# EAGLE design Kruispunt schema v2 (EAGLE 9.1.2)
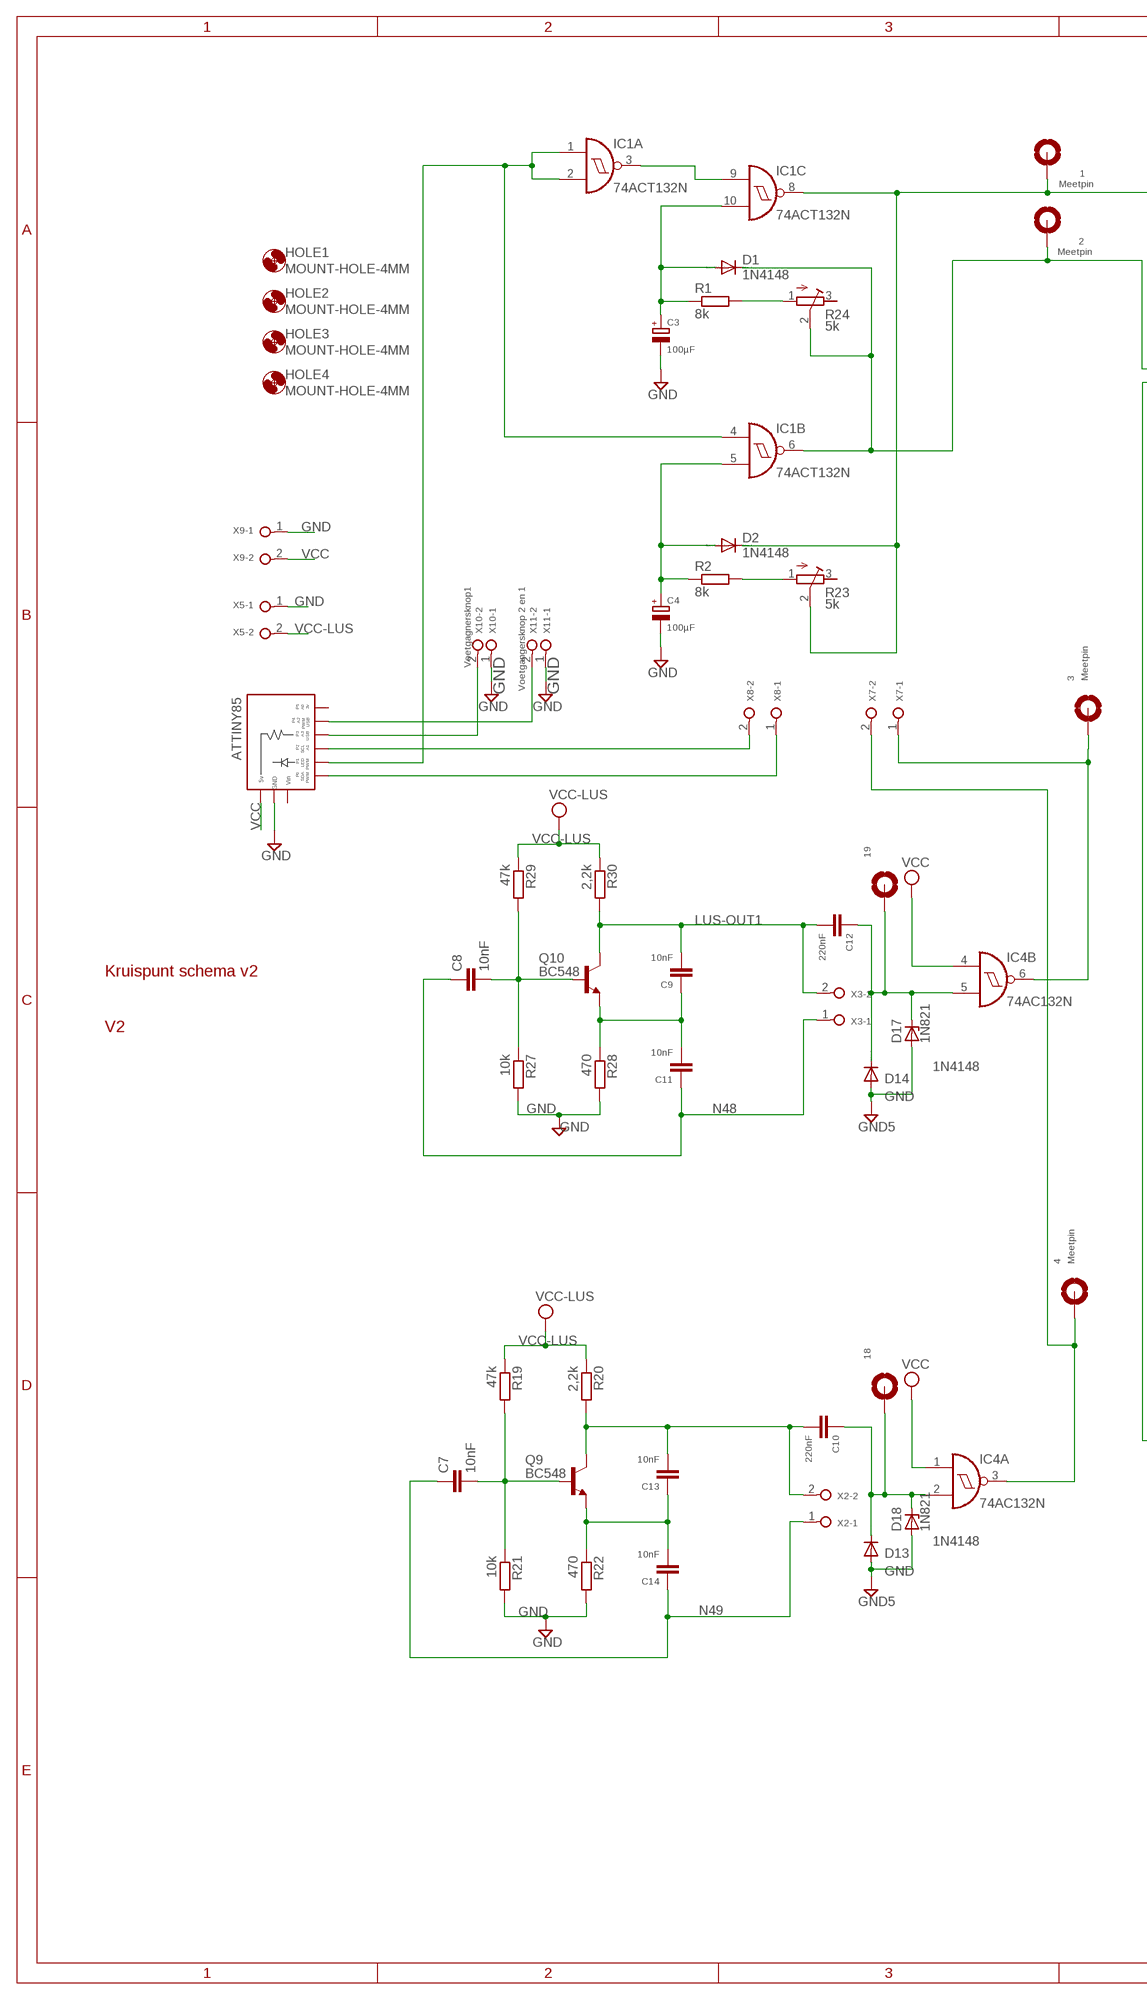
[diagram p0: schematic, sheet 1, part 1 of 2]
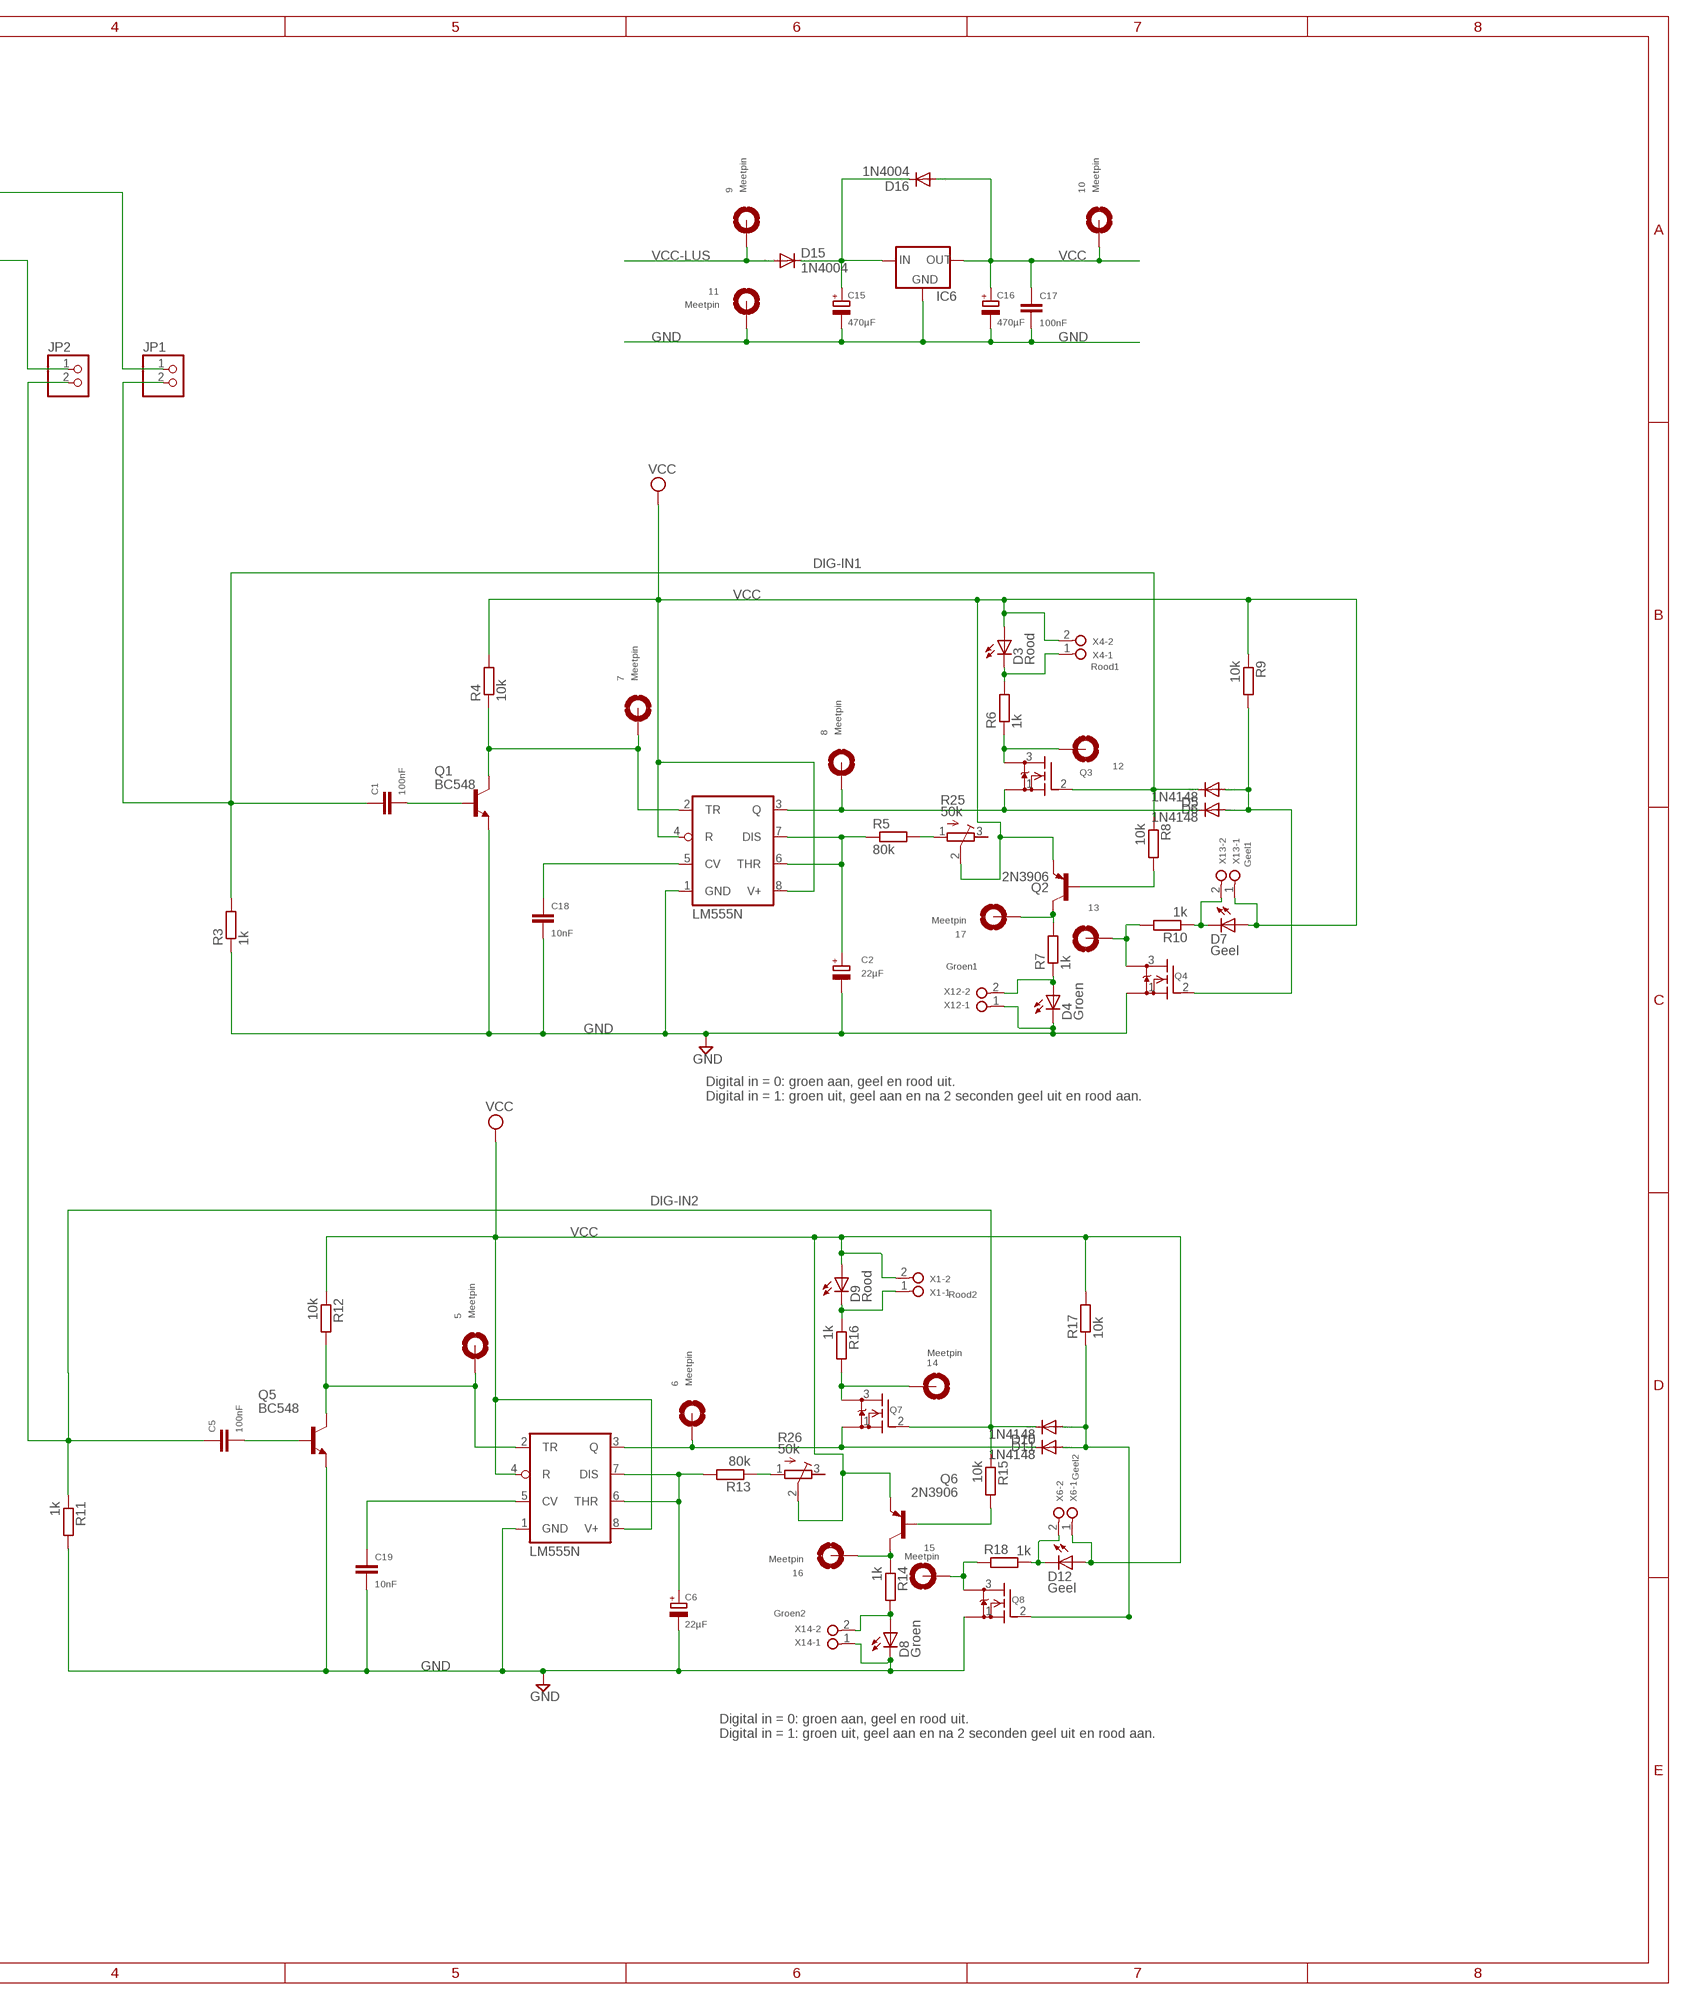
[diagram p1: schematic, sheet 1, part 2 of 2]

## Parts
1  Meetpin  WIREPAD  [PAD]
2  Meetpin  WIREPAD  [PAD]
3  Meetpin  WIREPAD  [PAD]
4  Meetpin  WIREPAD  [PAD]
5  Meetpin  WIREPAD  [PAD]
6  Meetpin  WIREPAD  [PAD]
7  Meetpin  WIREPAD  [PAD]
8  Meetpin  WIREPAD  [PAD]
9  Meetpin  WIREPAD  [PAD]
10  Meetpin  WIREPAD  [PAD]
11  Meetpin  WIREPAD  [PAD]
12  WIREPAD  [PAD]
13  WIREPAD  [PAD]
14  Meetpin  WIREPAD  [PAD]
15  Meetpin  WIREPAD  [PAD]
16  Meetpin  WIREPAD  [PAD]
17  Meetpin  WIREPAD  [PAD]
18  WIREPAD  [PAD]
19  WIREPAD  [PAD]
ATTINY85  DIGISPARK  [DIGISPARK]
C1  100nF  CERAMIC-CAP2LEADS  [CERAMIC-CAP-C050-025X075]
C2  22µF  ELCOELCO2,5MMLEAD  [ELCO-2.5MMLEAD]
C3  100µF  ELCOELCO2,5MMLEAD  [ELCO-2.5MMLEAD]
C4  100µF  ELCOELCO2,5MMLEAD  [ELCO-2.5MMLEAD]
C5  100nF  CERAMIC-CAP2LEADS  [CERAMIC-CAP-C050-025X075]
C6  22µF  ELCOELCO2,5MMLEAD  [ELCO-2.5MMLEAD]
C7  10nF  CERAMIC-CAP2LEADS  [CERAMIC-CAP-C050-025X075]
C8  10nF  CERAMIC-CAP2LEADS  [CERAMIC-CAP-C050-025X075]
C9  10nF  CERAMIC-CAP2LEADS  [CERAMIC-CAP-C050-025X075]
C10  220nF  CERAMIC-CAP3LEADS  [CERAMIC-CAP-C025_050-035X075]
C11  10nF  CERAMIC-CAP2LEADS  [CERAMIC-CAP-C050-025X075]
C12  220nF  CERAMIC-CAP3LEADS  [CERAMIC-CAP-C025_050-035X075]
C13  10nF  CERAMIC-CAP2LEADS  [CERAMIC-CAP-C050-025X075]
C14  10nF  CERAMIC-CAP2LEADS  [CERAMIC-CAP-C050-025X075]
C15  470µF  ELCOELCO5,0MMLEAD  [ELCO-5,0MMLEAD]
C16  470µF  ELCOELCO5,0MMLEAD  [ELCO-5,0MMLEAD]
C17  100nF  CERAMIC-CAP2LEADS  [CERAMIC-CAP-C050-025X075]
C18  10nF  CERAMIC-CAP2LEADS  [CERAMIC-CAP-C050-025X075]
C19  10nF  CERAMIC-CAP2LEADS  [CERAMIC-CAP-C050-025X075]
D1  1N4148  1N4148DO35-7  [DO35-7]
D2  1N4148  1N4148DO35-7  [DO35-7]
D3  Rood  TLLY4400  [LED3MM]
D4  Groen  TLLY4400  [LED3MM]
D5  1N4148  1N4148DO35-7  [DO35-7]
D6  1N4148  1N4148DO35-7  [DO35-7]
D7  Geel  TLLY4400  [LED3MM]
D8  Groen  TLLY4400  [LED3MM]
D9  Rood  TLLY4400  [LED3MM]
D10  1N4148  1N4148DO35-7  [DO35-7]
D11  1N4148  1N4148DO35-7  [DO35-7]
D12  Geel  TLLY4400  [LED3MM]
D13  1N4148  1N4148DO35-7  [DO35-7]
D14  1N4148  1N4148DO35-7  [DO35-7]
D15  1N4004  1N4148DO35-7  [DO35-7]
D16  1N4004  1N4148DO35-7  [DO35-7]
D17  1N821  [DO35Z10]
D18  1N821  [DO35Z10]
HOLE1  MOUNT-HOLE-4MM  [4,0]
HOLE2  MOUNT-HOLE-4MM  [4,0]
HOLE3  MOUNT-HOLE-4MM  [4,0]
HOLE4  MOUNT-HOLE-4MM  [4,0]
IC1  74ACT132N  [DIL14]
IC2  LM555N  [DIL08]
IC3  LM555N  [DIL08]
IC4  74AC132N  [DIL14]
IC6  LM78XX-TO220LM78XX-HEATSINK  [LM78XX-HEATSINK]
JP1  PINHD-1X2  [1X02]
JP2  PINHD-1X2  [1X02]
Q1  BC548  [TO92-CBE]
Q2  2N3906  [TO92-EBC]
Q3  2N7000  [TO-92]
Q4  2N7000  [TO-92]
Q5  BC548  [TO92-CBE]
Q6  2N3906  [TO92-EBC]
Q7  2N7000  [TO-92]
Q8  2N7000  [TO-92]
Q9  BC548  [TO92-CBE]
Q10  BC548  [TO92-CBE]
R1  8k  RESISTOR  [0207/10]
R2  8k  RESISTOR  [0207/10]
R3  1k  RESISTOR  [0207/10]
R4  10k  RESISTOR  [0207/10]
R5  80k  RESISTOR  [0207/10]
R6  1k  RESISTOR  [0207/10]
R7  1k  RESISTOR  [0207/10]
R8  10k  RESISTOR  [0207/10]
R9  10k  RESISTOR  [0207/10]
R10  1k  RESISTOR  [0207/10]
R11  1k  RESISTOR  [0207/10]
R12  10k  RESISTOR  [0207/10]
R13  80k  RESISTOR  [0207/10]
R14  1k  RESISTOR  [0207/10]
R15  10k  RESISTOR  [0207/10]
R16  1k  RESISTOR  [0207/10]
R17  10k  RESISTOR  [0207/10]
R18  1k  RESISTOR  [0207/10]
R19  47k  RESISTOR  [0207/10]
R20  2,2k  RESISTOR  [0207/10]
R21  10k  RESISTOR  [0207/10]
R22  470  RESISTOR  [0207/10]
R23  5k  R-TRIMM64W  [RTRIM64W]
R24  5k  R-TRIMM64W  [RTRIM64W]
R25  50k  R-TRIMM64W  [RTRIM64W]
R26  50k  R-TRIMM64W  [RTRIM64W]
R27  10k  RESISTOR  [0207/10]
R28  470  RESISTOR  [0207/10]
R29  47k  RESISTOR  [0207/10]
R30  2,2k  RESISTOR  [0207/10]
X1  Rood2  TERMINAL-5MM-2POLE  [W237-132]
X2  TERMINAL-5MM-2POLE  [W237-132]
X3  TERMINAL-5MM-2POLE  [W237-132]
X4  Rood1  TERMINAL-5MM-2POLE  [W237-132]
X5  TERMINAL-5MM-2POLE  [W237-132]
X6  Geel2  TERMINAL-5MM-2POLE  [W237-132]
X7  TERMINAL-5MM-2POLE  [W237-132]
X8  TERMINAL-5MM-2POLE  [W237-132]
X9  TERMINAL-5MM-2POLE  [W237-132]
X10  Voetgagnersknop1  TERMINAL-5MM-2POLE  [W237-132]
X11  Voetgangersknop 2 en 1  TERMINAL-5MM-2POLE  [W237-132]
X12  Groen1  TERMINAL-5MM-2POLE  [W237-132]
X13  Geel1  TERMINAL-5MM-2POLE  [W237-132]
X14  Groen2  TERMINAL-5MM-2POLE  [W237-132]

## Nets
DIG-IN1: C1.P$2 D6.C JP1.2 Q3.2(G) R3.2 R8.1
DIG-IN2: C5.P$2 D11.C JP2.2 Q7.2(G) R11.1 R15.1
GND [VCC]: 11.P$1(MOUNT) ATTINY85.GND ATTINY85.GND1(GND) C2.- C3.- C4.- C6.- C15.- C16.- C17.P$1 C18.P$1 C19.P$1 D4.K(C) D8.K(C) D13.A D14.A D17.A D18.A IC2.1(GND) IC3.1(GND) IC6.GND Q1.E Q4.1(S) Q5.E Q8.1(S) R3.1 R11.2 R21.2 R22.2 R27.2 R28.2 X5.1 X9.1 X10.1 X11.1 X12.1 X14.1 ; supply symbol labelled GND5
LUS-OUT1: C9.P$1 C12.P$1 Q10.C R30.2 X3.2
N48 [VCC]: C8.P$2 C11.P$2 X3.1
N49 [VCC]: C7.P$2 C14.P$2 X2.1
N$1: C4.+ D2.A IC1.5(B:I1) R2.1
N$2: IC1.3(A:O) IC1.9(C:I0)
N$3: ATTINY85.P1 IC1.1(A:I0) IC1.2(A:I1) IC1.4(B:I0)
N$4: C1.P$1 Q1.B
N$5: R13.1 R26.1(A)
N$6: 1.P$1(MOUNT) D2.C IC1.8(C:O) JP1.1 R23.2(S)
N$7: C3.+ D1.A IC1.10(C:I1) R1.1
N$8: 7.P$1(MOUNT) IC2.2(TR) Q1.C R4.1
N$9: C2.+ IC2.6(THR) IC2.7(DIS) R5.1
N$10: 17.P$1(MOUNT) Q2.C R7.2
N$11: D4.A R7.1 X12.2
N$12: Q2.B R8.2
N$13: 12.P$1(MOUNT) Q3.3(D) R6.1
N$14: D3.K(C) R6.2 X4.1
N$15: 8.P$1(MOUNT) D5.C IC2.3(Q) Q3.1(S)
N$16: R2.2 R23.1(A)
N$17: 13.P$1(MOUNT) Q4.3(D) R10.2
N$18: D7.K(C) R10.1 X13.2
N$19: C5.P$1 Q5.B
N$20: 5.P$1(MOUNT) IC3.2(TR) Q5.C R12.2
N$21: C6.+ IC3.6(THR) IC3.7(DIS) R13.2
N$22: 16.P$1(MOUNT) Q6.C R14.1
N$23: D8.A R14.2 X14.2
N$24: Q6.B R15.2
N$25: 14.P$1(MOUNT) Q7.3(D) R16.2
N$26: ATTINY85.P3 X10.2
N$27: 6.P$1(MOUNT) D10.C IC3.3(Q) Q7.1(S)
N$28: D10.A D11.A Q8.2(G) R17.1
N$29: 15.P$1(MOUNT) Q8.3(D) R18.1
N$30: D12.K(C) R18.2 X6.2
N$31: C7.P$1 Q9.B R19.2 R21.1
N$32: C13.P$2 C14.P$1 Q9.E R22.1
N$33: C10.P$1 C13.P$1 Q9.C R20.2 X2.2
N$34: 18.P$1(MOUNT) C10.P$2 C10.P$3 D13.C D18.C IC4.2(A:I1)
N$35: 4.P$1(MOUNT) IC4.3(A:O) X7.2
N$36: R1.2 R24.1(A)
N$37: R5.2 R25.1(A)
N$38: C19.P$2 IC3.5(CV)
N$39: C8.P$1 Q10.B R27.1 R29.2
N$40: C9.P$2 C11.P$1 Q10.E R28.1
N$41: D5.A D6.A Q4.2(G) R9.2
N$42: 19.P$1(MOUNT) C12.P$2 C12.P$3 D14.C D17.C IC4.5(B:I1)
N$43: C18.P$2 IC2.5(CV)
N$44: 3.P$1(MOUNT) IC4.6(B:O) X7.1
N$45: C15.+ D15.C D16.C IC6.IN
N$46: ATTINY85.P4 X11.2
N$47: 2.P$1(MOUNT) D1.C IC1.6(B:O) JP2.1 R24.2(S)
N$48: ATTINY85.P2 X8.2
N$49: D9.K(C) R16.1 X1.1
N$50: ATTINY85.P0 X8.1
VCC [VCC]: 10.P$1(MOUNT) ATTINY85.5V ATTINY85.5V1(5V) C16.+ C17.P$2 D3.A D7.A D9.A D12.A D16.A IC2.4(R) IC2.8(V+) IC3.4(R) IC3.8(V+) IC4.1(A:I0) IC4.4(B:I0) IC6.OUT Q2.E Q6.E R4.2 R9.1 R12.1 R17.2 R25.2(S) R26.2(S) X1.2 X4.2 X6.1 X9.2 X13.1
VCC-LUS [VCC]: 9.P$1(MOUNT) D15.A R19.1 R20.1 R29.1 R30.1 X5.2
Unconnected: ATTINY85.P5 IC1.11(D:O) IC1.12(D:I0) IC1.13(D:I1) IC4.8(C:O) IC4.9(C:I0) IC4.10(C:I1) IC4.11(D:O) IC4.12(D:I0) IC4.13(D:I1) R23.3(E) R24.3(E) R25.3(E) R26.3(E)

## Notes on the sheet
- V2
- Digital in = 0: groen aan, geel en rood uit.
  Digital in = 1: groen uit, geel aan en na 2 seconden geel uit en rood aan.
- Digital in = 0: groen aan, geel en rood uit.
  Digital in = 1: groen uit, geel aan en na 2 seconden geel uit en rood aan.

## Power pins joined to a net without a drawn wire
GND: IC1.7(P:GND) IC4.7(P:GND)
VCC: IC1.14(P:VCC) IC4.14(P:VCC)
VIN: ATTINY85.VIN ATTINY85.VIN1(VIN)

## Library data of the parts
1-19 = Kruispunt Library:WIREPAD: Wirepad
ATTINY85 = Kruispunt Library:DIGISPARK: Digispark http://digistump.com/wiki/digispark
C1 C5 C7-C9 C11 C13 C14 C17-C19 = test(3):CERAMIC-CAP: ceramic capacitor leads 2.5mm and 5.5mm
C2-C4 C6 C15 C16 = Kruispunt Library:ELCO: electrolytic capacitor 2.5mm or 3.5mm lead or SMD
C10 C12 = Kruispunt Library:CERAMIC-CAP: ceramic capacitor leads 2.5mm and 5.5mm
D1 D2 D5 D6 D10 D11 D13-D16 = Kruispunt Library:1N4148: DIODE high speed (Philips)
D3 D4 D7-D9 D12 = Hardware lichtsturing library:TLLY4400: Low Current (2mA) LED 3 mm Tinted Diffused Package color YELLOW Source: Data sheet <http://www.farnell.com/datasheets/391098.pdf>; MF: VISHAY SEMICONDUCTOR; OC_FARNELL: 1612439
D17 D18 = Kruispunt Library:1N821: Reference DIODE temperature compensated, 6,2 V
HOLE1-HOLE4 = Kruispunt Library:MOUNT-HOLE-4MM
IC1 IC4 = Kruispunt Library:74*132: Quad 2-input NAND schmitt trigger
IC2 IC3 = Kruispunt Library:*555: TIMER
IC6 = Kruispunt Library:LM78XX-TO220: LM78xx TO220 VOLTAGE REGULATOR
JP1 JP2 = Kruispunt Library:PINHD-1X2: PIN HEADER
Q1 Q5 Q9 Q10 = Kruispunt Library:BC548*: NPN Transistor
Q2 Q6 = Kruispunt Library:2N3906: PNP Transistor
Q3 Q4 Q7 Q8 = Kruispunt Library:2N7000: Silicon N-Channel MOS FET 0.35A TTL-logic
R1-R22 R27-R30 = Kruispunt Library:RESISTOR
R23-R26 = Kruispunt Library:R-TRIMM: Trimm resistor
X1-X14 = Kruispunt Library:TERMINAL-5MM-2POLE: WAGO SCREW CLAMP; OC_FARNELL: unknown; OC_NEWARK: unknown

## Net classes
0 default: clearance 0.205 mm
1 VCC: width 1.016 mm, clearance 0.205 mm to class 0, clearance 0.205 mm

## Board
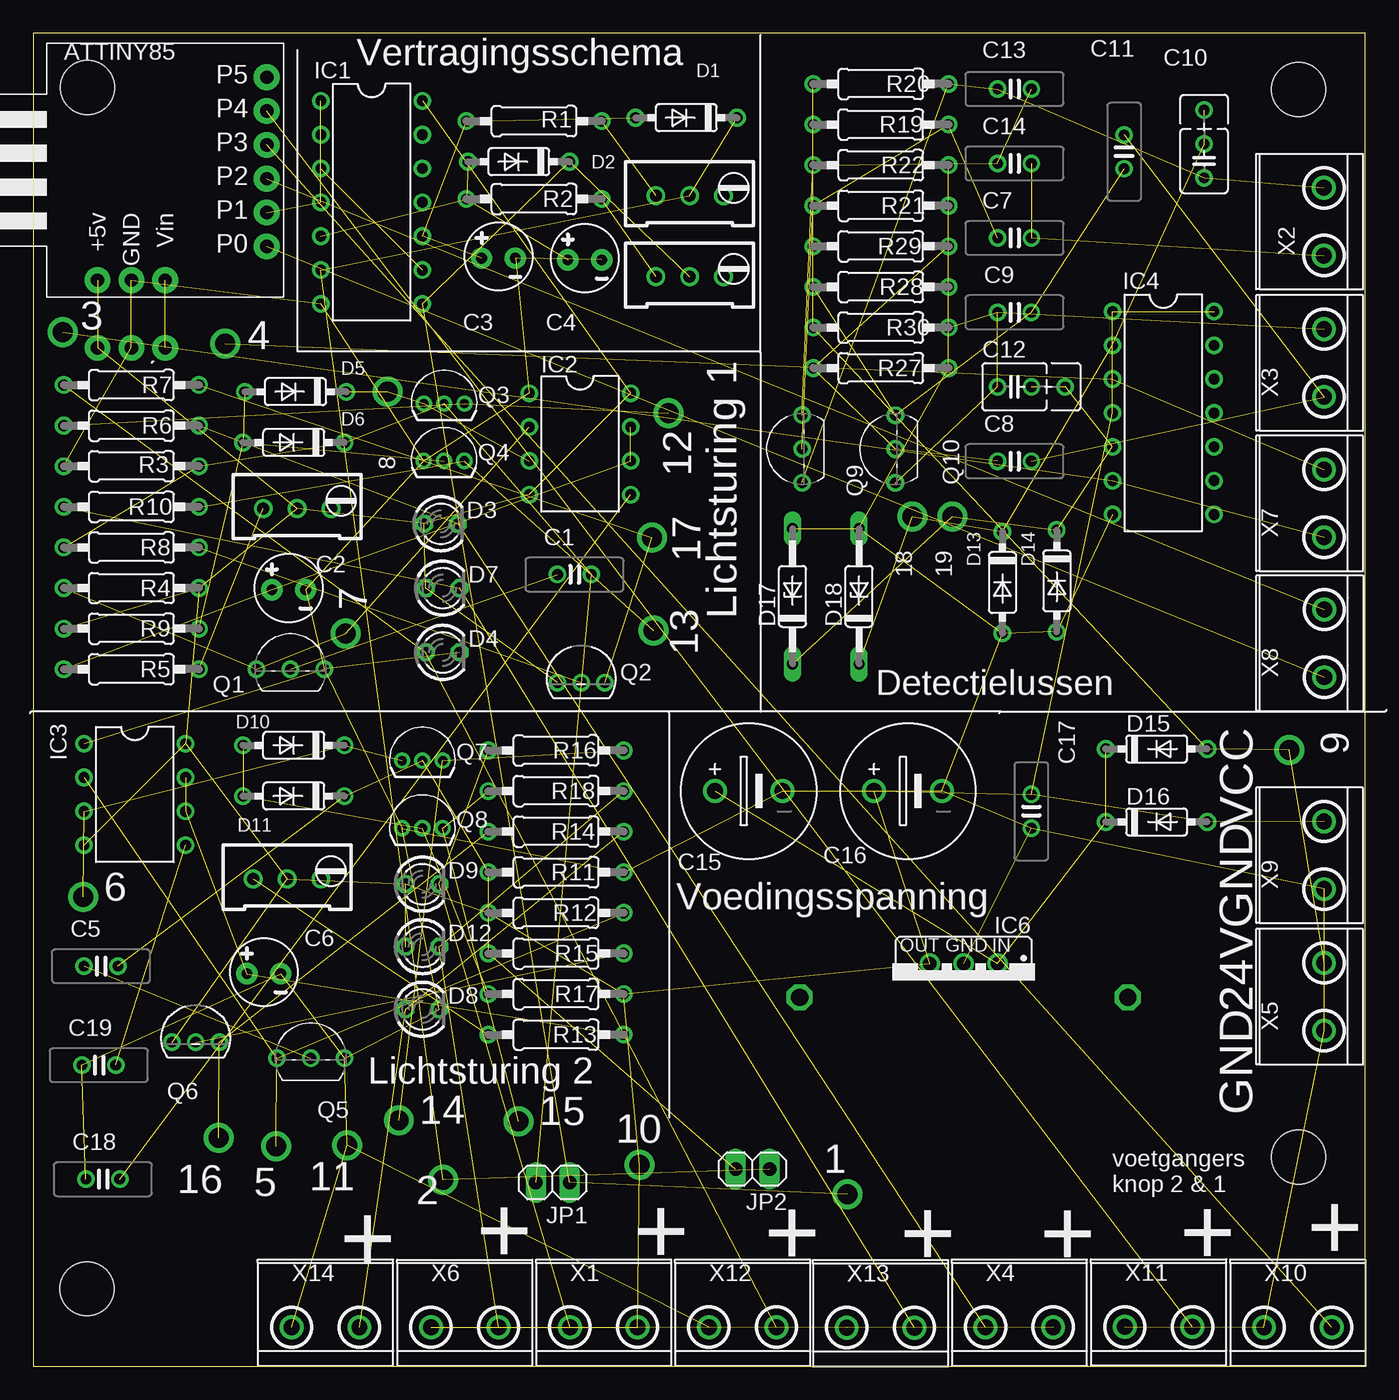
[diagram p2: board, top side]
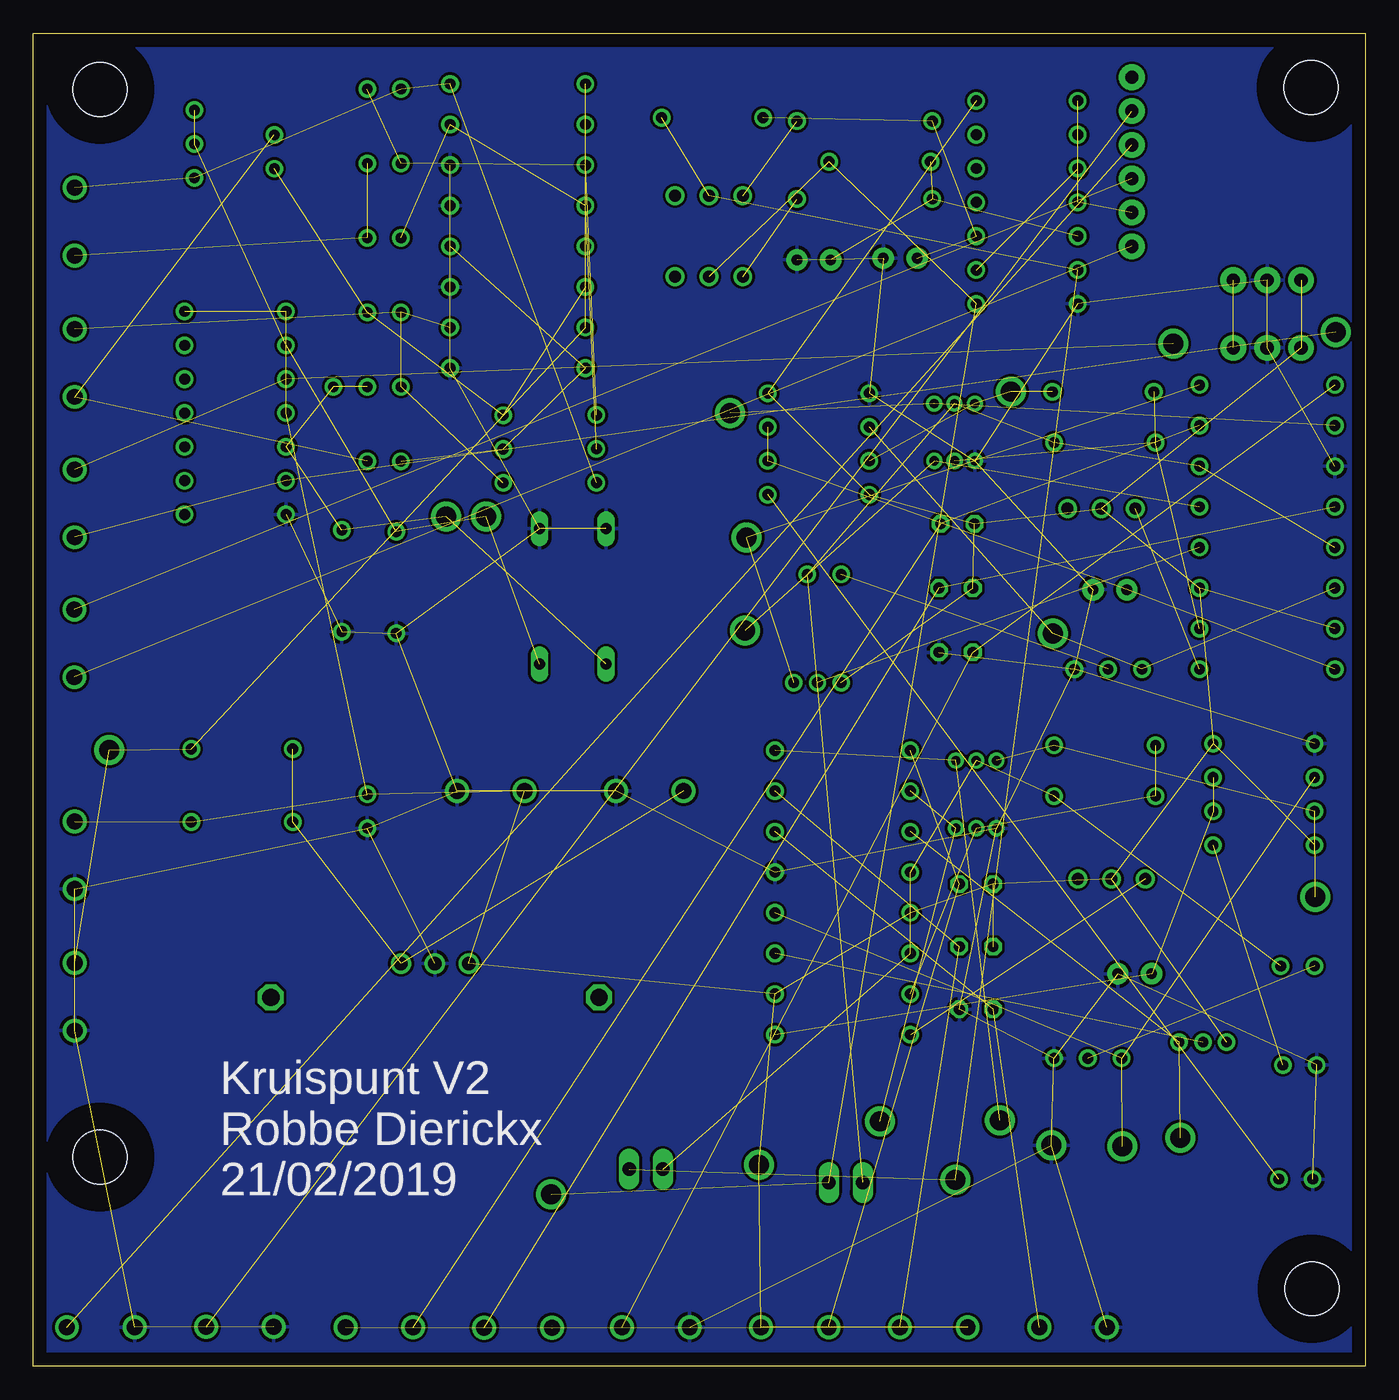
[diagram p3: board, bottom side, seen from below]

Size 100 x 100.07 mm. Coordinates in mm from the lower left corner, seen from the top.
Outline: 0,0 100,0 100,100.07 0,100.07 0,0
Copper layers (1*16): Top 0.035mm / dielectric 1.5mm / Bottom 0.035mm
Design rules "default *": minimum track width 10mil, minimum drill 0.35mm, track to track 8mil, track to pad 8mil, pad to pad 8mil, via to via 8mil, smd to smd 6mil, copper to edge 40mil, drill to drill 8mil, minimum pad ring 10mil, minimum via ring 8mil, stop-mask expansion 4mil, vias tented up to drill 0mil, thermal gap 10mil

### Footprints (pad centres in the part's own frame; a part is rotated, then mirrored left to right if it is on the bottom)
PAD = drill 1.5: P$1 0,0
DIGISPARK = drill 1 pad 1.93: 5V 17.78,3.81; 5V1 22.86,3.81; GND 17.78,6.35; GND1 22.86,6.35; P0 15.24,16.51; P1 12.7,16.51; P2 10.16,16.51; P3 7.62,16.51; P4 5.08,16.51; P5 2.54,16.51; VIN 17.78,8.89; VIN1 22.86,8.89
CERAMIC-CAP-C050-025X075 = drill 0.8: P$1 -1.27,0; P$2 1.27,0
ELCO-2.5MMLEAD = drill 0.8 pad 1.6: + -1.27,0; - 1.27,0
CERAMIC-CAP-C025_050-035X075 = drill 0.8: P$1 -1.27,0; P$2 1.27,0; P$3 3.81,0
ELCO-5,0MMLEAD = drill 1.2: + -2.54,0; - 2.54,0
DO35-7 = drill 0.813: A 3.81,0; C -3.81,0
LED3MM = drill 0.813 octagon: A -1.27,0; K 1.27,0
DO35Z10 = drill 0.813 long: A 5.08,0; C -5.08,0
4,0 = hole 4.064: 0,0
DIL14 = drill 0.813: 1 -7.62,-3.81; 2 -5.08,-3.81; 3 -2.54,-3.81; 4 0,-3.81; 5 2.54,-3.81; 6 5.08,-3.81; 7 7.62,-3.81; 8 7.62,3.81; 9 5.08,3.81; 10 2.54,3.81; 11 0,3.81; 12 -2.54,3.81; 13 -5.08,3.81; 14 -7.62,3.81
DIL08 = drill 0.813: 1 -3.81,-3.81; 2 -1.27,-3.81; 3 1.27,-3.81; 4 3.81,-3.81; 5 3.81,3.81; 6 1.27,3.81; 7 -1.27,3.81; 8 -3.81,3.81
LM78XX-HEATSINK = drill 1.016: GND 0,-2.54; IN -2.54,-2.54; OUT 2.54,-2.54 | drill 1.3 octagon: P$1 -12.319,0; P$2 12.319,0
1X02 = drill 1.016 long: 1 -1.27,0; 2 1.27,0
TO92-CBE = drill 0.813: B 0,-1.27; C -2.54,-1.27; E 2.54,-1.27
TO92-EBC = drill 0.8: B 0,-0.127; C 1.778,-0.127; E -1.778,-0.127
TO-92 = drill 0.7: 1 -1.524,0; 2 0,0; 3 1.524,0
0207/10 = drill 0.813: 1 -5.08,0; 2 5.08,0
RTRIM64W = drill 0.9: 1 1.27,-2.54; 2 1.27,0; 3 1.27,2.54
W237-132 = drill 1.194: 1 -2.54,-0.635; 2 2.54,-0.635

### Placement (x,y rotation side)
1  61.12,12.89 0 top
2  30.76,14 0 top
3  2.22,77.64 0 top
4  14.41,76.78 0 top
5  18.24,16.52 0 top
6  3.76,35.22 0 top
7  23.44,55.01 0 top
8  26.61,73.16 0 top
9  94.31,46.25 0 top
10  45.51,15.12 0 top
11  23.57,16.56 0 top
12  47.69,71.56 0 top
13  46.56,55.22 0 top
14  27.44,18.45 0 top
15  36.44,18.37 0 top
16  13.91,17.15 0 top
17  46.44,62.21 0 top
18  66,63.8 270 top
19  69,63.8 270 top
ATTINY85  1.02,99.31 270 top
C1  40.62,59.44 0 top
C2  19.18,58.29 0 top
C3  34.92,83.19 0 top
C4  41.4,83.06 0 top
C5  5.08,30.04 0 top
C6  17.3,29.46 0 top
C7  73.66,84.71 0 top
C8  73.66,67.94 0 top
C9  73.66,79.12 0 top
C10  87.9,90.49 90 top
C11  81.9,91.17 90 top
C12  73.66,73.53 0 top
C13  73.66,95.88 0 top
C14  73.66,90.3 0 top
C15  53.72,43.18 0 top
C16  65.66,43.18 0 top
C17  74.93,41.66 90 top
C18  5.22,14.04 0 top
C19  4.92,22.6 0 top
D1  49.02,93.73 180 top
D2  36.45,90.42 180 top
D3  30.61,63.25 0 top
D4  30.73,53.59 0 top
D5  19.68,73.15 180 top
D6  19.56,69.34 180 top
D7  30.73,58.42 0 top
D8  29.21,26.8 0 top
D9  29.21,36.2 0 top
D10  19.56,46.61 180 top
D11  19.56,42.8 180 top
D12  29.21,31.5 0 top
D13  72.76,58.83 270 top
D14  76.84,58.96 270 top
D15  84.33,46.34 0 top
D16  84.33,40.86 0 top
D17  57,57.8 90 top
D18  62,57.8 90 top
HOLE1  94.99,15.7 0 top
HOLE2  94.99,95.85 0 top
HOLE3  4.08,96 0 top
HOLE4  4.02,5.81 0 top
IC1  25.4,87.38 270 top
IC2  41.04,69.24 270 top
IC3  7.62,42.93 270 top
IC4  84.84,71.56 270 top
IC6  69.85,27.69 180 top
JP1  39,13.8 180 top
JP2  54,14.8 180 top
Q1  19.3,53.59 0 top
Q2  41.13,51.45 0 top
Q3  30.84,72.26 0 top
Q4  30.83,67.97 0 top
Q5  20.83,24.38 0 top
Q6  12.19,24.45 0 top
Q7  29.21,45.47 0 top
Q8  29.21,40.39 0 top
Q9  56.45,68.87 90 top
Q10  63.45,68.85 90 top
R1  37.59,93.47 0 top
R2  37.59,87.63 0 top
R3  7.37,67.56 0 top
R4  7.37,58.42 0 top
R5  7.37,52.32 0 top
R6  7.37,70.61 0 top
R7  7.37,73.66 0 top
R8  7.37,61.47 0 top
R9  7.37,55.37 0 top
R10  7.37,64.52 0 top
R11  39.24,37.08 0 top
R12  39.24,34.04 0 top
R13  39.24,24.89 0 top
R14  39.24,40.13 0 top
R15  39.24,30.99 0 top
R16  39.24,46.23 0 top
R17  39.24,27.94 0 top
R18  39.24,43.18 0 top
R19  63.63,93.22 0 top
R20  63.63,96.27 0 top
R21  63.63,87.12 0 top
R22  63.63,90.17 0 top
R23  49.28,83.06 270 top
R24  49.28,89.15 270 top
R25  19.81,65.66 270 top
R26  19.05,37.85 270 top
R27  63.63,74.93 0 top
R28  63.63,81.03 0 top
R29  63.63,84.07 0 top
R30  63.63,77.98 0 top
X1  42.83,3.57 0 top
X2  96.25,85.92 90 top
X3  96.27,75.31 90 top
X4  74.03,3.57 0 top
X5  96.27,27.73 90 top
X6  32.39,3.56 0 top
X7  96.27,64.77 90 top
X8  96.28,54.26 90 top
X9  96.27,38.36 90 top
X10  94.94,3.56 0 top
X11  84.49,3.59 0 top
X12  53.26,3.57 0 top
X13  63.61,3.53 0 top
X14  21.94,3.56 0 top

### Tracks (layer width: path | path; a pad name or v marks a point on that pad's centre or on a via)
DIG-IN1  (5 unrouted)
DIG-IN2  (5 unrouted)
GND  (38 unrouted)
  pour Bottom: 0,100.8 100,100.8 100,-0.2 0,-0.2
LUS-OUT1  (4 unrouted)
N48  (2 unrouted)
N49  (2 unrouted)
N$1  (3 unrouted)
N$2  (1 unrouted)
N$3  (3 unrouted)
N$4  (1 unrouted)
N$5  (1 unrouted)
N$6  (4 unrouted)
N$7  (3 unrouted)
N$8  (3 unrouted)
N$9  (3 unrouted)
N$10  (2 unrouted)
N$11  (2 unrouted)
N$12  (1 unrouted)
N$13  (2 unrouted)
N$14  (2 unrouted)
N$15  (3 unrouted)
N$16  (1 unrouted)
N$17  (2 unrouted)
N$18  (2 unrouted)
N$19  (1 unrouted)
N$20  (3 unrouted)
N$21  (3 unrouted)
N$22  (2 unrouted)
N$23  (2 unrouted)
N$24  (1 unrouted)
N$25  (2 unrouted)
N$26  (1 unrouted)
N$27  (3 unrouted)
N$28  (3 unrouted)
N$29  (2 unrouted)
N$30  (2 unrouted)
N$31  (3 unrouted)
N$32  (3 unrouted)
N$33  (4 unrouted)
N$34  (5 unrouted)
N$35  (2 unrouted)
N$36  (1 unrouted)
N$37  (1 unrouted)
N$38  (1 unrouted)
N$39  (3 unrouted)
N$40  (3 unrouted)
N$41  (3 unrouted)
N$42  (5 unrouted)
N$43  (1 unrouted)
N$44  (2 unrouted)
N$45  (3 unrouted)
N$46  (1 unrouted)
N$47  (4 unrouted)
N$48  (1 unrouted)
N$49  (2 unrouted)
N$50  (1 unrouted)
VCC  (31 unrouted)
VCC-LUS  (6 unrouted)
VIN  (1 unrouted)

### Text on the board
tPlace: Lichtsturing 1 | Detectielussen | VCC | Voedingsspanning | 24V | GND | Lichtsturing 2 | GND | voetgangers / knop 2 & 1 | + | + | + | + | + | + | + | +
bPlace: Kruispunt V2 / Robbe Dierickx / 21/02/2019
tNames: Vertragingsschema